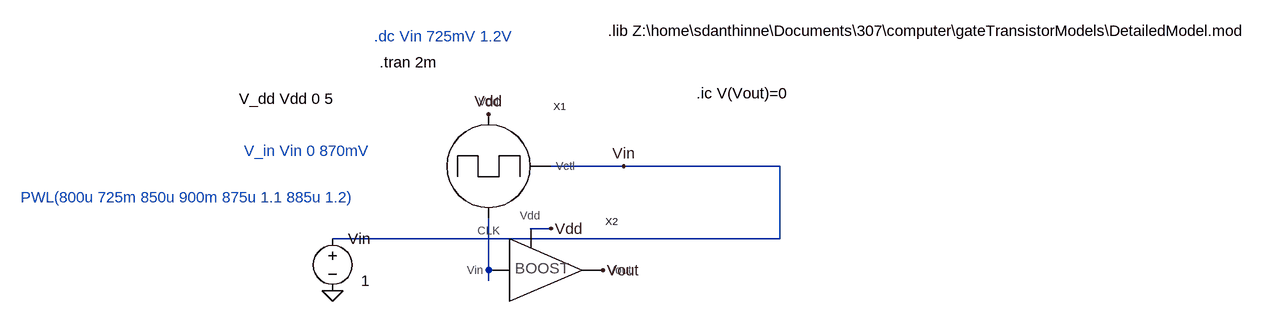
[diagram p0: schematic clkTest.asc]
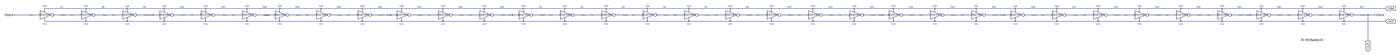
[diagram p1: sub-circuit s_clock.asc, whole sheet]
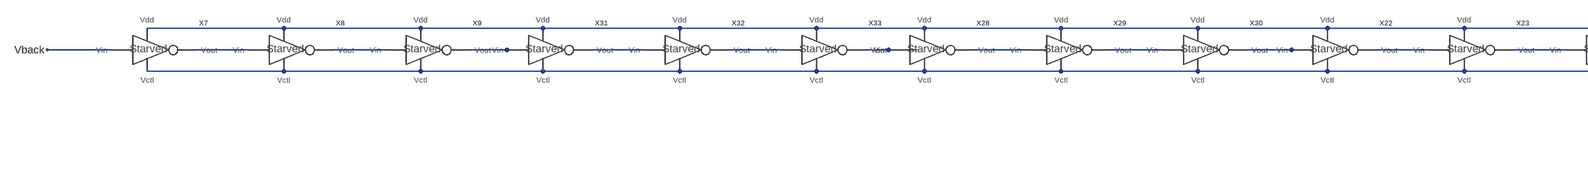
[diagram p2: sub-circuit s_clock.asc, part, row 1 of 1, column 1 of 3]
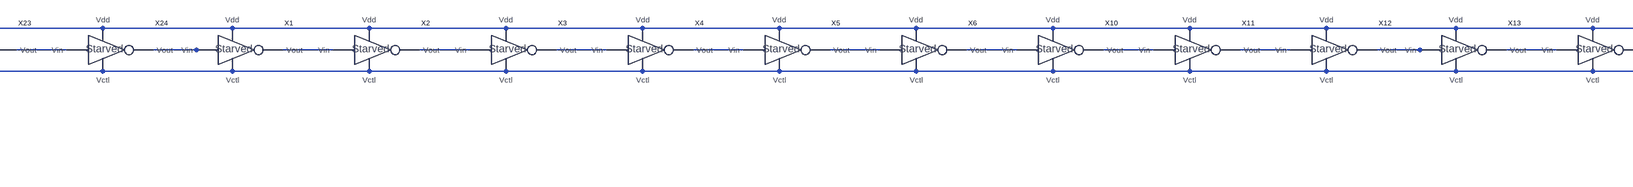
[diagram p3: sub-circuit s_clock.asc, part, row 1 of 1, column 2 of 3]
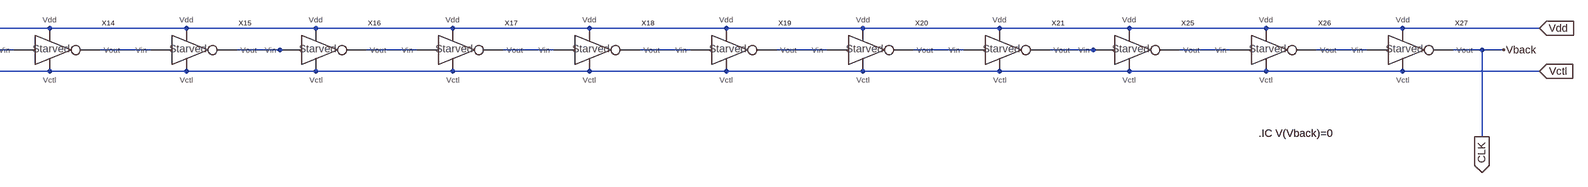
[diagram p4: sub-circuit s_clock.asc, part, row 1 of 1, column 3 of 3]
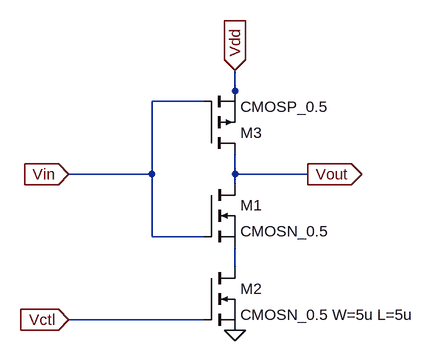
[diagram p5: sub-circuit s_starv_current_inv.asc]
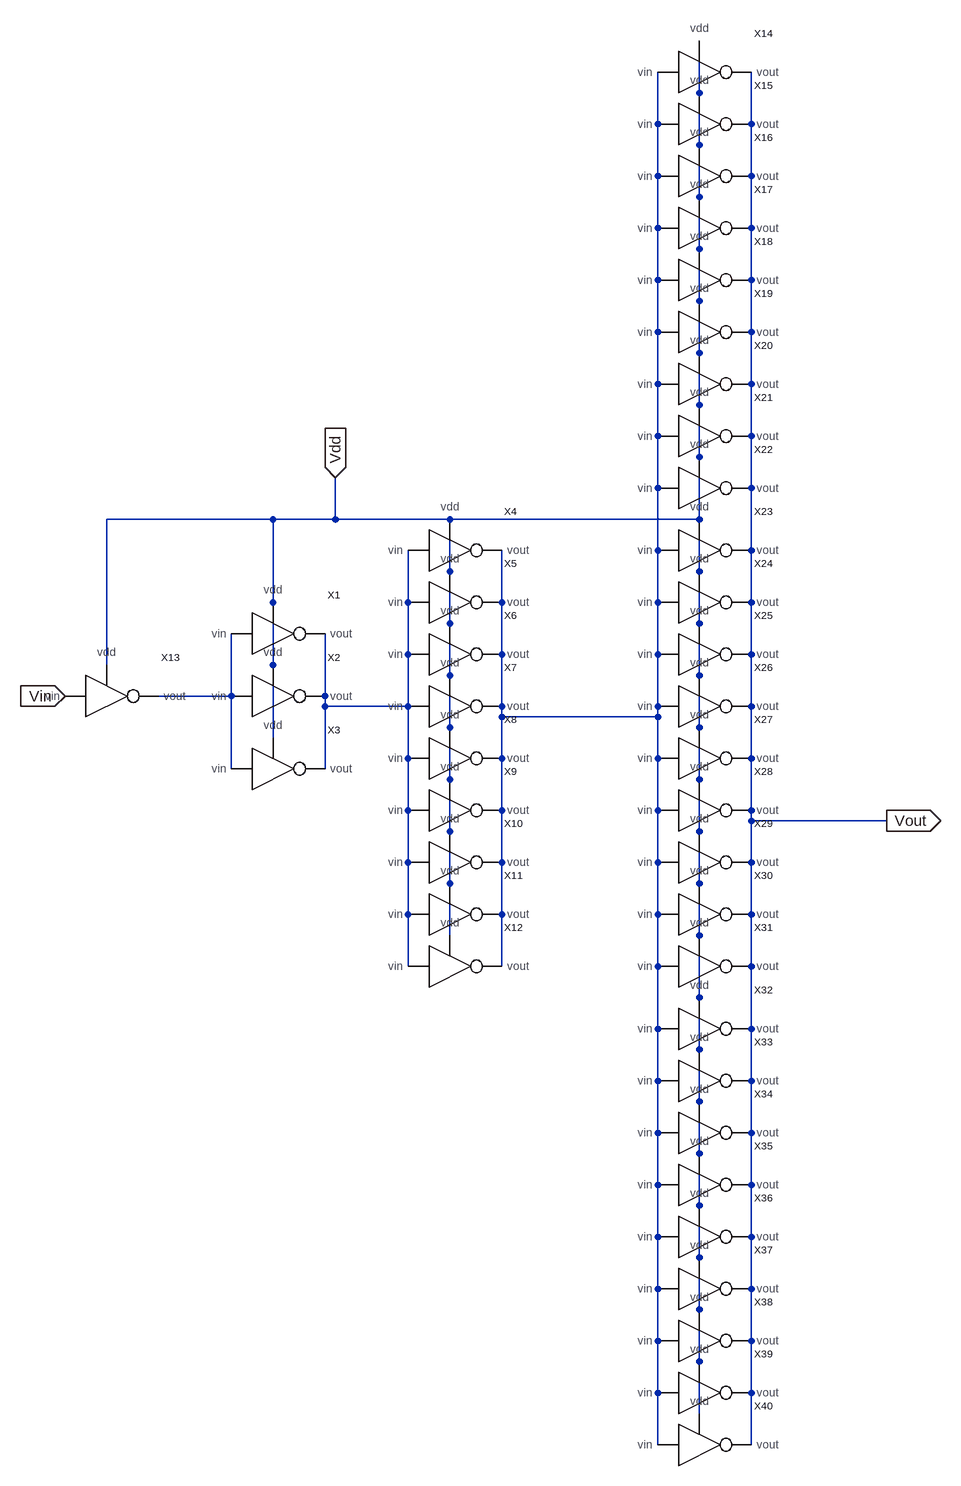
[diagram p6: sub-circuit s_current_boost.asc]
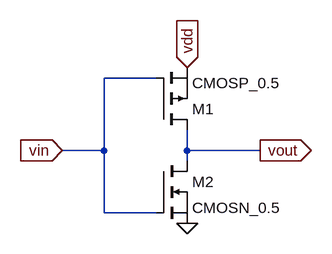
[diagram p7: sub-circuit s_inv.asc]
clkTest.asc, the LTspice schematic file:
Version 4
SHEET 1 1496 680
WIRE 416 160 304 160
WIRE 656 160 416 160
WIRE 304 256 272 256
WIRE 656 272 656 160
WIRE 656 272 -32 272
WIRE 208 320 208 240
WIRE 208 336 208 320
FLAG 208 80 Vdd
FLAG 384 320 Vout
FLAG 416 160 Vin
FLAG -32 352 0
FLAG 304 256 Vdd
SYMBOL s_clock 208 160 R0
SYMATTR InstName X1
SYMBOL voltage -32 256 R0
WINDOW 3 44 80 Left 2
WINDOW 123 0 0 Left 0
WINDOW 39 0 0 Left 0
SYMATTR Value 1
SYMATTR InstName Vin
SYMBOL s_current_boost 272 320 R0
SYMATTR InstName X2
TEXT -176 56 Left 2 !V_dd Vdd 0 5
TEXT 32 -40 Left 2 ;.dc Vin 725mV 1.2V
TEXT 40 0 Left 2 !.tran 2m
TEXT -168 136 Left 2 ;V_in Vin 0 870mV
TEXT 392 -48 Left 2 !.lib Z:\\home\\sdanthinne\\Documents\\307\\computer\\gateTransistorModels\\DetailedModel.mod
TEXT 528 48 Left 2 !.ic V(Vout)=0
TEXT -512 208 Left 2 ;PWL(800u 725m 850u 900m 875u 1.1 885u 1.2)

s_clock.asc, the sub-circuit schematic file:
Version 4
SHEET 1 6728 1060
WIRE -2928 160 -3232 160
WIRE -2624 160 -2928 160
WIRE -2352 160 -2624 160
WIRE -2048 160 -2352 160
WIRE -1744 160 -2048 160
WIRE -1504 160 -1744 160
WIRE -1200 160 -1504 160
WIRE -896 160 -1200 160
WIRE -608 160 -896 160
WIRE -304 160 -608 160
WIRE 0 160 -304 160
WIRE 288 160 0 160
WIRE 592 160 288 160
WIRE 896 160 592 160
WIRE 1200 160 896 160
WIRE 1504 160 1200 160
WIRE 1808 160 1504 160
WIRE 2112 160 1808 160
WIRE 2416 160 2112 160
WIRE 2720 160 2416 160
WIRE 3008 160 2720 160
WIRE 3312 160 3008 160
WIRE 3616 160 3312 160
WIRE 3904 160 3616 160
WIRE 4208 160 3904 160
WIRE 4512 160 4208 160
WIRE 4816 160 4512 160
WIRE 5120 160 4816 160
WIRE 5424 160 5120 160
WIRE 5712 160 5424 160
WIRE 6016 160 5712 160
WIRE 6320 160 6016 160
WIRE 6624 160 6320 160
WIRE -3312 208 -3696 208
WIRE -3008 208 -3120 208
WIRE -2704 208 -2816 208
WIRE -2432 208 -2512 208
WIRE -2400 208 -2432 208
WIRE -2128 208 -2240 208
WIRE -1824 208 -1936 208
WIRE -1584 208 -1632 208
WIRE -1520 208 -1584 208
WIRE -1280 208 -1392 208
WIRE -976 208 -1088 208
WIRE -688 208 -784 208
WIRE -672 208 -688 208
WIRE -384 208 -496 208
WIRE -80 208 -192 208
WIRE 208 208 112 208
WIRE 224 208 208 208
WIRE 512 208 400 208
WIRE 816 208 704 208
WIRE 1120 208 1008 208
WIRE 1424 208 1312 208
WIRE 1728 208 1616 208
WIRE 2032 208 1920 208
WIRE 2336 208 2224 208
WIRE 2640 208 2528 208
WIRE 2928 208 2832 208
WIRE 2944 208 2928 208
WIRE 3232 208 3120 208
WIRE 3536 208 3424 208
WIRE 3824 208 3728 208
WIRE 3840 208 3824 208
WIRE 4128 208 4016 208
WIRE 4432 208 4320 208
WIRE 4736 208 4624 208
WIRE 5040 208 4928 208
WIRE 5344 208 5232 208
WIRE 5632 208 5536 208
WIRE 5648 208 5632 208
WIRE 5936 208 5824 208
WIRE 6240 208 6128 208
WIRE 6496 208 6432 208
WIRE 6544 208 6496 208
WIRE -2928 256 -3232 256
WIRE -2624 256 -2928 256
WIRE -2352 256 -2624 256
WIRE -2048 256 -2352 256
WIRE -1744 256 -2048 256
WIRE -1504 256 -1744 256
WIRE -1200 256 -1504 256
WIRE -896 256 -1200 256
WIRE -608 256 -896 256
WIRE -304 256 -608 256
WIRE 0 256 -304 256
WIRE 288 256 0 256
WIRE 592 256 288 256
WIRE 896 256 592 256
WIRE 1200 256 896 256
WIRE 1504 256 1200 256
WIRE 1808 256 1504 256
WIRE 2112 256 1808 256
WIRE 2416 256 2112 256
WIRE 2720 256 2416 256
WIRE 3008 256 2720 256
WIRE 3312 256 3008 256
WIRE 3616 256 3312 256
WIRE 3904 256 3616 256
WIRE 4208 256 3904 256
WIRE 4512 256 4208 256
WIRE 4816 256 4512 256
WIRE 5120 256 4816 256
WIRE 5424 256 5120 256
WIRE 5712 256 5424 256
WIRE 6016 256 5712 256
WIRE 6320 256 6016 256
WIRE 6624 256 6320 256
WIRE 6496 432 6496 208
FLAG -3696 208 Vback
FLAG 6544 208 Vback
FLAG 6496 432 CLK
IOPIN 6496 432 Out
FLAG 6624 160 Vdd
IOPIN 6624 160 In
FLAG 6624 256 Vctl
IOPIN 6624 256 In
SYMBOL s_starv_current_inv 288 208 R0
SYMATTR InstName X1
SYMBOL s_starv_current_inv 592 208 R0
SYMATTR InstName X2
SYMBOL s_starv_current_inv 896 208 R0
SYMATTR InstName X3
SYMBOL s_starv_current_inv 1200 208 R0
SYMATTR InstName X4
SYMBOL s_starv_current_inv 1504 208 R0
SYMATTR InstName X5
SYMBOL s_starv_current_inv 1808 208 R0
SYMATTR InstName X6
SYMBOL s_starv_current_inv -3232 208 R0
SYMATTR InstName X7
SYMBOL s_starv_current_inv -2928 208 R0
SYMATTR InstName X8
SYMBOL s_starv_current_inv -2624 208 R0
SYMATTR InstName X9
SYMBOL s_starv_current_inv 2112 208 R0
SYMATTR InstName X10
SYMBOL s_starv_current_inv 2416 208 R0
SYMATTR InstName X11
SYMBOL s_starv_current_inv 2720 208 R0
SYMATTR InstName X12
SYMBOL s_starv_current_inv 3008 208 R0
SYMATTR InstName X13
SYMBOL s_starv_current_inv 3312 208 R0
SYMATTR InstName X14
SYMBOL s_starv_current_inv 3616 208 R0
SYMATTR InstName X15
SYMBOL s_starv_current_inv 3904 208 R0
SYMATTR InstName X16
SYMBOL s_starv_current_inv 4208 208 R0
SYMATTR InstName X17
SYMBOL s_starv_current_inv 4512 208 R0
SYMATTR InstName X18
SYMBOL s_starv_current_inv 4816 208 R0
SYMATTR InstName X19
SYMBOL s_starv_current_inv 5120 208 R0
SYMATTR InstName X20
SYMBOL s_starv_current_inv 5424 208 R0
SYMATTR InstName X21
SYMBOL s_starv_current_inv -608 208 R0
SYMATTR InstName X22
SYMBOL s_starv_current_inv -304 208 R0
SYMATTR InstName X23
SYMBOL s_starv_current_inv 0 208 R0
SYMATTR InstName X24
SYMBOL s_starv_current_inv 5712 208 R0
SYMATTR InstName X25
SYMBOL s_starv_current_inv 6016 208 R0
SYMATTR InstName X26
SYMBOL s_starv_current_inv 6320 208 R0
SYMATTR InstName X27
SYMBOL s_starv_current_inv -1504 208 R0
SYMATTR InstName X28
SYMBOL s_starv_current_inv -1200 208 R0
SYMATTR InstName X29
SYMBOL s_starv_current_inv -896 208 R0
SYMATTR InstName X30
SYMBOL s_starv_current_inv -2352 208 R0
SYMATTR InstName X31
SYMBOL s_starv_current_inv -2048 208 R0
SYMATTR InstName X32
SYMBOL s_starv_current_inv -1744 208 R0
SYMATTR InstName X33
TEXT 6000 424 Left 2 !.IC V(Vback)=0

s_starv_current_inv.asc, the sub-circuit schematic file:
Version 4
SHEET 1 880 680
WIRE 176 -16 176 -48
WIRE 128 0 48 0
WIRE 176 0 176 -16
WIRE 48 112 48 0
WIRE 48 112 -80 112
WIRE 176 112 176 80
WIRE 288 112 176 112
WIRE 176 128 176 112
WIRE 48 208 48 112
WIRE 128 208 48 208
WIRE 176 256 176 224
WIRE 128 336 -80 336
FLAG 176 352 0
FLAG -80 336 Vctl
IOPIN -80 336 In
FLAG -80 112 Vin
IOPIN -80 112 In
FLAG 288 112 Vout
IOPIN 288 112 Out
FLAG 176 -48 Vdd
IOPIN 176 -48 In
SYMBOL nmos 128 128 R0
SYMATTR InstName M1
SYMATTR Value CMOSN_0.5
SYMBOL nmos 128 256 R0
SYMATTR InstName M2
SYMATTR Value CMOSN_0.5 W=5u L=5u
SYMBOL pmos 128 80 M180
SYMATTR InstName M3
SYMATTR Value CMOSP_0.5

s_current_boost.asc, the sub-circuit schematic file:
Version 4
SHEET 1 1556 1460
WIRE 768 -704 768 -784
WIRE 704 -656 704 -736
WIRE 848 -656 848 -736
WIRE 768 -624 768 -704
WIRE 704 -576 704 -656
WIRE 848 -576 848 -656
WIRE 768 -544 768 -624
WIRE 704 -496 704 -576
WIRE 848 -496 848 -576
WIRE 768 -464 768 -544
WIRE 704 -416 704 -496
WIRE 848 -416 848 -496
WIRE 768 -384 768 -464
WIRE 704 -336 704 -416
WIRE 848 -336 848 -416
WIRE 768 -304 768 -384
WIRE 704 -256 704 -336
WIRE 848 -256 848 -336
WIRE 768 -224 768 -304
WIRE 704 -176 704 -256
WIRE 848 -176 848 -256
WIRE 768 -144 768 -224
WIRE 704 -96 704 -176
WIRE 848 -96 848 -176
WIRE 112 -48 -144 -48
WIRE 208 -48 208 -112
WIRE 208 -48 112 -48
WIRE 384 -48 208 -48
WIRE 768 -48 768 -144
WIRE 768 -48 384 -48
WIRE 704 0 704 -96
WIRE 848 0 848 -96
WIRE 384 32 384 -48
WIRE 768 32 768 -48
WIRE 112 80 112 -48
WIRE 320 80 320 0
WIRE 464 80 464 0
WIRE 704 80 704 0
WIRE 848 80 848 0
WIRE 384 112 384 32
WIRE 768 112 768 32
WIRE 320 160 320 80
WIRE 464 160 464 80
WIRE 704 160 704 80
WIRE 848 160 848 80
WIRE -144 176 -144 -48
WIRE 112 176 112 80
WIRE 384 192 384 112
WIRE 768 192 768 112
WIRE 48 224 48 128
WIRE 48 224 -64 224
WIRE 192 224 192 128
WIRE 192 240 192 224
WIRE 320 240 320 160
WIRE 320 240 192 240
WIRE 464 240 464 160
WIRE 704 240 704 160
WIRE 848 240 848 160
WIRE 464 256 464 240
WIRE 704 256 704 240
WIRE 704 256 464 256
WIRE 384 272 384 192
WIRE 768 272 768 192
WIRE 112 288 112 176
WIRE 320 320 320 240
WIRE 464 320 464 256
WIRE 704 320 704 256
WIRE 848 320 848 240
WIRE 48 336 48 224
WIRE 192 336 192 240
WIRE 384 352 384 272
WIRE 768 352 768 272
WIRE 320 400 320 320
WIRE 464 400 464 320
WIRE 704 400 704 320
WIRE 848 400 848 320
WIRE 848 416 848 400
WIRE 1056 416 848 416
WIRE 384 432 384 352
WIRE 768 432 768 352
WIRE 320 480 320 400
WIRE 464 480 464 400
WIRE 704 480 704 400
WIRE 848 480 848 416
WIRE 384 512 384 432
WIRE 768 512 768 432
WIRE 320 560 320 480
WIRE 464 560 464 480
WIRE 704 560 704 480
WIRE 848 560 848 480
WIRE 384 592 384 512
WIRE 768 592 768 512
WIRE 320 640 320 560
WIRE 464 640 464 560
WIRE 704 640 704 560
WIRE 848 640 848 560
WIRE 768 688 768 592
WIRE 704 736 704 640
WIRE 848 736 848 640
WIRE 768 768 768 688
WIRE 704 816 704 736
WIRE 848 816 848 736
WIRE 768 848 768 768
WIRE 704 896 704 816
WIRE 848 896 848 816
WIRE 768 928 768 848
WIRE 704 976 704 896
WIRE 848 976 848 896
WIRE 768 1008 768 928
WIRE 704 1056 704 976
WIRE 848 1056 848 976
WIRE 768 1088 768 1008
WIRE 704 1136 704 1056
WIRE 848 1136 848 1056
WIRE 768 1168 768 1088
WIRE 704 1216 704 1136
WIRE 848 1216 848 1136
WIRE 768 1248 768 1168
WIRE 704 1296 704 1216
WIRE 848 1296 848 1216
WIRE 768 1328 768 1248
WIRE 704 1376 704 1296
WIRE 848 1376 848 1296
FLAG 208 -112 Vdd
IOPIN 208 -112 In
FLAG -208 224 Vin
IOPIN -208 224 In
FLAG 1056 416 Vout
IOPIN 1056 416 Out
SYMBOL s_inv 112 128 R0
SYMATTR InstName X1
SYMBOL s_inv 112 224 R0
SYMATTR InstName X2
SYMBOL s_inv 112 336 R0
SYMATTR InstName X3
SYMBOL s_inv 384 0 R0
SYMATTR InstName X4
SYMBOL s_inv 384 80 R0
SYMATTR InstName X5
SYMBOL s_inv 384 160 R0
SYMATTR InstName X6
SYMBOL s_inv 384 240 R0
SYMATTR InstName X7
SYMBOL s_inv 384 320 R0
SYMATTR InstName X8
SYMBOL s_inv 384 400 R0
SYMATTR InstName X9
SYMBOL s_inv 384 480 R0
SYMATTR InstName X10
SYMBOL s_inv 384 560 R0
SYMATTR InstName X11
SYMBOL s_inv 384 640 R0
SYMATTR InstName X12
SYMBOL s_inv -144 224 R0
SYMATTR InstName X13
SYMBOL s_inv 768 -736 R0
SYMATTR InstName X14
SYMBOL s_inv 768 -656 R0
SYMATTR InstName X15
SYMBOL s_inv 768 -576 R0
SYMATTR InstName X16
SYMBOL s_inv 768 -496 R0
SYMATTR InstName X17
SYMBOL s_inv 768 -416 R0
SYMATTR InstName X18
SYMBOL s_inv 768 -336 R0
SYMATTR InstName X19
SYMBOL s_inv 768 -256 R0
SYMATTR InstName X20
SYMBOL s_inv 768 -176 R0
SYMATTR InstName X21
SYMBOL s_inv 768 -96 R0
SYMATTR InstName X22
SYMBOL s_inv 768 0 R0
SYMATTR InstName X23
SYMBOL s_inv 768 80 R0
SYMATTR InstName X24
SYMBOL s_inv 768 160 R0
SYMATTR InstName X25
SYMBOL s_inv 768 240 R0
SYMATTR InstName X26
SYMBOL s_inv 768 320 R0
SYMATTR InstName X27
SYMBOL s_inv 768 400 R0
SYMATTR InstName X28
SYMBOL s_inv 768 480 R0
SYMATTR InstName X29
SYMBOL s_inv 768 560 R0
SYMATTR InstName X30
SYMBOL s_inv 768 640 R0
SYMATTR InstName X31
SYMBOL s_inv 768 736 R0
SYMATTR InstName X32
SYMBOL s_inv 768 816 R0
SYMATTR InstName X33
SYMBOL s_inv 768 896 R0
SYMATTR InstName X34
SYMBOL s_inv 768 976 R0
SYMATTR InstName X35
SYMBOL s_inv 768 1056 R0
SYMATTR InstName X36
SYMBOL s_inv 768 1136 R0
SYMATTR InstName X37
SYMBOL s_inv 768 1216 R0
SYMATTR InstName X38
SYMBOL s_inv 768 1296 R0
SYMATTR InstName X39
SYMBOL s_inv 768 1376 R0
SYMATTR InstName X40

s_inv.asc, the sub-circuit schematic file:
Version 4
SHEET 1 880 680
WIRE 128 -112 48 -112
WIRE 48 0 48 -112
WIRE 48 0 -16 0
WIRE 176 0 176 -32
WIRE 288 0 176 0
WIRE 176 16 176 0
WIRE 48 96 48 0
WIRE 128 96 48 96
FLAG 288 0 vout
IOPIN 288 0 Out
FLAG -16 0 vin
IOPIN -16 0 In
FLAG 176 -128 vdd
IOPIN 176 -128 In
FLAG 176 112 0
SYMBOL pmos 128 -32 M180
SYMATTR InstName M1
SYMATTR Value CMOSP_0.5
SYMBOL nmos 128 16 R0
SYMATTR InstName M2
SYMATTR Value CMOSN_0.5

The netlist it stands for:
* clkTest.asc
XX1 Vdd N001 Vin s_clock
Vin Vin 0 1
XX2 Vout N001 Vdd s_current_boost

* block symbol definitions
.subckt s_clock Vdd CLK Vctl
XX1 N013 N012 Vdd Vctl s_starv_current_inv
XX2 N014 N013 Vdd Vctl s_starv_current_inv
XX3 N015 N014 Vdd Vctl s_starv_current_inv
XX4 N016 N015 Vdd Vctl s_starv_current_inv
XX5 N017 N016 Vdd Vctl s_starv_current_inv
XX6 N018 N017 Vdd Vctl s_starv_current_inv
XX7 N001 CLK Vdd Vctl s_starv_current_inv
XX8 N002 N001 Vdd Vctl s_starv_current_inv
XX9 N003 N002 Vdd Vctl s_starv_current_inv
XX10 N019 N018 Vdd Vctl s_starv_current_inv
XX11 N020 N019 Vdd Vctl s_starv_current_inv
XX12 N021 N020 Vdd Vctl s_starv_current_inv
XX13 N022 N021 Vdd Vctl s_starv_current_inv
XX14 N023 N022 Vdd Vctl s_starv_current_inv
XX15 N024 N023 Vdd Vctl s_starv_current_inv
XX16 N025 N024 Vdd Vctl s_starv_current_inv
XX17 N026 N025 Vdd Vctl s_starv_current_inv
XX18 N027 N026 Vdd Vctl s_starv_current_inv
XX19 N028 N027 Vdd Vctl s_starv_current_inv
XX20 N029 N028 Vdd Vctl s_starv_current_inv
XX21 N030 N029 Vdd Vctl s_starv_current_inv
XX22 N010 N009 Vdd Vctl s_starv_current_inv
XX23 N011 N010 Vdd Vctl s_starv_current_inv
XX24 N012 N011 Vdd Vctl s_starv_current_inv
XX25 N031 N030 Vdd Vctl s_starv_current_inv
XX26 N032 N031 Vdd Vctl s_starv_current_inv
XX27 CLK N032 Vdd Vctl s_starv_current_inv
XX28 N007 N006 Vdd Vctl s_starv_current_inv
XX29 N008 N007 Vdd Vctl s_starv_current_inv
XX30 N009 N008 Vdd Vctl s_starv_current_inv
XX31 N004 N003 Vdd Vctl s_starv_current_inv
XX32 N005 N004 Vdd Vctl s_starv_current_inv
XX33 N006 N005 Vdd Vctl s_starv_current_inv
.IC V(Vback)=0
.ends s_clock

.subckt s_starv_current_inv Vout Vin Vdd Vctl
M1 Vout Vin N001 N001 CMOSN_0.5
M2 N001 Vctl 0 0 CMOSN_0.5 W=5u L=5u
M3 Vout Vin Vdd Vdd CMOSP_0.5
.ends s_starv_current_inv

.subckt s_current_boost Vout Vin Vdd
XX1 N003 N002 Vdd s_inv
XX2 N003 N002 Vdd s_inv
XX3 N003 N002 Vdd s_inv
XX4 N002 N001 Vdd s_inv
XX5 N002 N001 Vdd s_inv
XX6 N002 N001 Vdd s_inv
XX7 N002 N001 Vdd s_inv
XX8 N002 N001 Vdd s_inv
XX9 N002 N001 Vdd s_inv
XX10 N002 N001 Vdd s_inv
XX11 N002 N001 Vdd s_inv
XX12 N002 N001 Vdd s_inv
XX13 Vin N003 Vdd s_inv
XX14 N001 Vout Vdd s_inv
XX15 N001 Vout Vdd s_inv
XX16 N001 Vout Vdd s_inv
XX17 N001 Vout Vdd s_inv
XX18 N001 Vout Vdd s_inv
XX19 N001 Vout Vdd s_inv
XX20 N001 Vout Vdd s_inv
XX21 N001 Vout Vdd s_inv
XX22 N001 Vout Vdd s_inv
XX23 N001 Vout Vdd s_inv
XX24 N001 Vout Vdd s_inv
XX25 N001 Vout Vdd s_inv
XX26 N001 Vout Vdd s_inv
XX27 N001 Vout Vdd s_inv
XX28 N001 Vout Vdd s_inv
XX29 N001 Vout Vdd s_inv
XX30 N001 Vout Vdd s_inv
XX31 N001 Vout Vdd s_inv
XX32 N001 Vout Vdd s_inv
XX33 N001 Vout Vdd s_inv
XX34 N001 Vout Vdd s_inv
XX35 N001 Vout Vdd s_inv
XX36 N001 Vout Vdd s_inv
XX37 N001 Vout Vdd s_inv
XX38 N001 Vout Vdd s_inv
XX39 N001 Vout Vdd s_inv
XX40 N001 Vout Vdd s_inv
.ends s_current_boost

.subckt s_inv vin vout vdd
M1 vout vin vdd vdd CMOSP_0.5
M2 vout vin 0 0 CMOSN_0.5
.ends s_inv

.model NMOS NMOS
.model PMOS PMOS
.lib standard.mos
V_dd Vdd 0 5
* .dc Vin 725mV 1.2V
.tran 2m
* V_in Vin 0 870mV
.lib Z:\home\sdanthinne\Documents\307\computer\gateTransistorModels\DetailedModel.mod
.ic V(Vout)=0
* PWL(800u 725m 850u 900m 875u 1.1 885u 1.2)
.backanno
.end